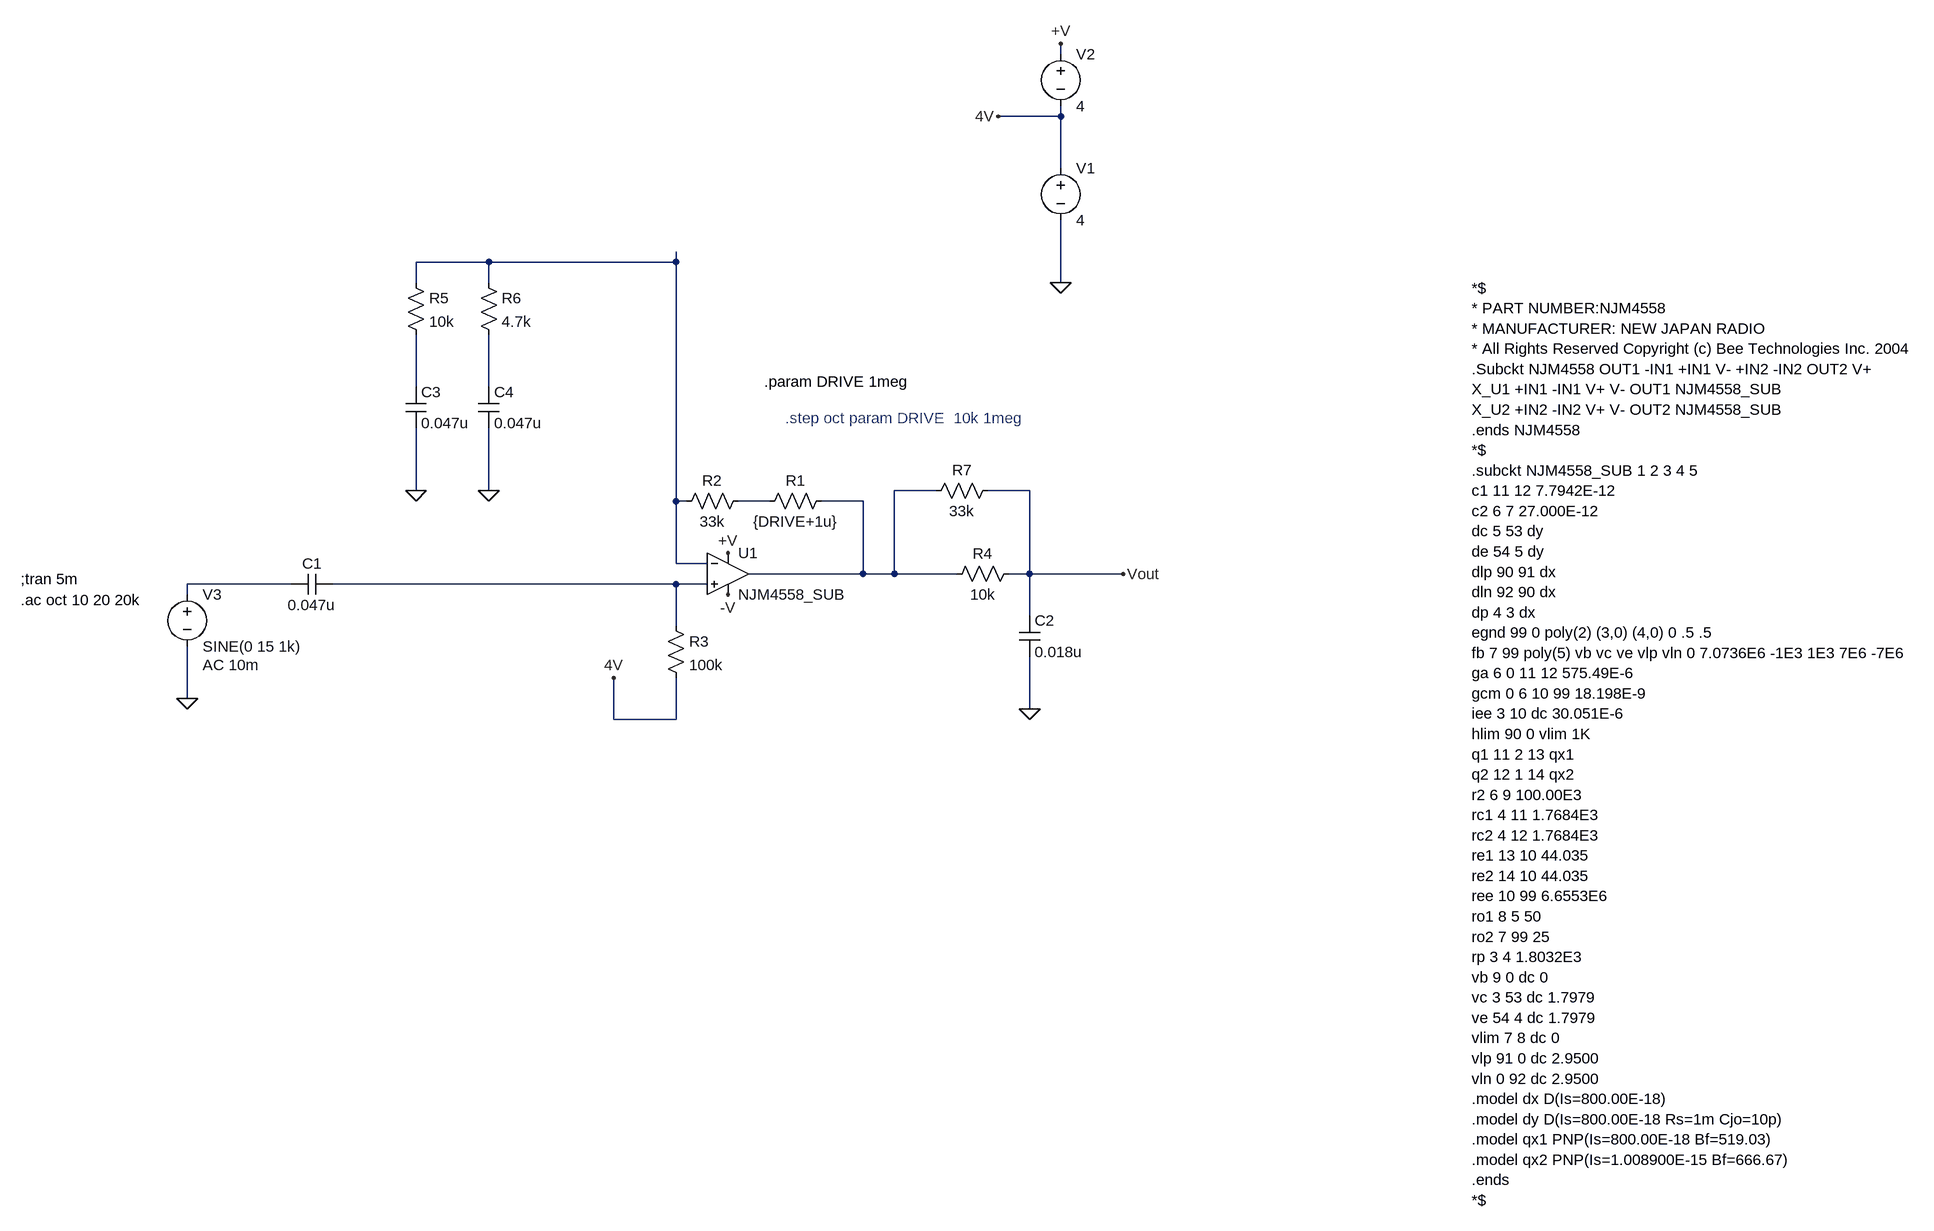
[diagram p0: schematic SD-1filter.asc]
SD-1filter.asc, the LTspice schematic file:
Version 4
SHEET 1 2008 1608
WIRE 560 -160 560 -176
WIRE 560 -64 560 -80
WIRE 560 -64 464 -64
WIRE 560 16 560 -64
WIRE -320 160 -432 160
WIRE -32 160 -32 144
WIRE -32 160 -320 160
WIRE -432 192 -432 160
WIRE -320 192 -320 160
WIRE 560 192 560 96
WIRE -432 352 -432 272
WIRE -320 352 -320 272
WIRE -432 512 -432 416
WIRE -320 512 -320 416
WIRE 368 512 304 512
WIRE 512 512 448 512
WIRE -32 528 -32 160
WIRE -16 528 -32 528
WIRE 112 528 64 528
WIRE 256 528 192 528
WIRE -32 624 -32 528
WIRE 16 624 -32 624
WIRE 256 640 256 528
WIRE 256 640 80 640
WIRE 304 640 304 512
WIRE 304 640 256 640
WIRE 400 640 304 640
WIRE 512 640 512 512
WIRE 512 640 480 640
WIRE 656 640 512 640
WIRE -624 656 -784 656
WIRE -32 656 -560 656
WIRE 16 656 -32 656
WIRE -784 672 -784 656
WIRE 512 704 512 640
WIRE -32 720 -32 656
WIRE -784 832 -784 752
WIRE 512 848 512 768
WIRE -128 864 -128 800
WIRE -32 864 -32 800
WIRE -32 864 -128 864
FLAG -784 832 0
FLAG 560 192 0
FLAG 560 -176 +V
FLAG 48 608 +V
FLAG 48 672 -V
FLAG 464 -64 4V
FLAG -128 800 4V
FLAG 656 640 Vout
FLAG -320 512 0
FLAG -432 512 0
FLAG 512 848 0
SYMBOL Opamps\\opamp2 48 576 R0
SYMATTR InstName U1
SYMATTR Value NJM4558_SUB
SYMBOL voltage 560 0 R0
WINDOW 123 0 0 Left 2
WINDOW 39 0 0 Left 2
SYMATTR InstName V1
SYMATTR Value 4
SYMBOL voltage 560 -176 R0
WINDOW 123 0 0 Left 2
WINDOW 39 0 0 Left 2
SYMATTR InstName V2
SYMATTR Value 4
SYMBOL voltage -784 656 R0
WINDOW 123 24 124 Left 2
WINDOW 39 0 0 Left 2
SYMATTR Value2 AC 10m
SYMATTR InstName V3
SYMATTR Value SINE(0 15 1k)
SYMBOL res 208 512 R90
WINDOW 0 0 56 VBottom 2
WINDOW 3 32 56 VTop 2
SYMATTR InstName R1
SYMATTR Value {DRIVE+1u}
SYMBOL cap -560 640 R90
WINDOW 0 0 32 VBottom 2
WINDOW 3 32 32 VTop 2
SYMATTR InstName C1
SYMATTR Value 0.047u
SYMBOL res -48 704 R0
SYMATTR InstName R3
SYMATTR Value 100k
SYMBOL res 80 512 R90
WINDOW 0 0 56 VBottom 2
WINDOW 3 32 56 VTop 2
SYMATTR InstName R2
SYMATTR Value 33k
SYMBOL res 496 624 R90
WINDOW 0 0 56 VBottom 2
WINDOW 3 32 56 VTop 2
SYMATTR InstName R4
SYMATTR Value 10k
SYMBOL cap 496 704 R0
SYMATTR InstName C2
SYMATTR Value 0.018u
SYMBOL res -448 176 R0
SYMATTR InstName R5
SYMATTR Value 10k
SYMBOL res -336 176 R0
SYMATTR InstName R6
SYMATTR Value 4.7k
SYMBOL cap -448 352 R0
SYMATTR InstName C3
SYMATTR Value 0.047u
SYMBOL cap -336 352 R0
SYMATTR InstName C4
SYMATTR Value 0.047u
SYMBOL res 464 496 R90
WINDOW 0 0 56 VBottom 2
WINDOW 3 32 56 VTop 2
SYMATTR InstName R7
SYMATTR Value 33k
TEXT 1192 200 Left 2 !*$\n* PART NUMBER:NJM4558\n* MANUFACTURER: NEW JAPAN RADIO\n* All Rights Reserved Copyright (c) Bee Technologies Inc. 2004\n.Subckt NJM4558 OUT1 -IN1 +IN1 V- +IN2 -IN2 OUT2 V+\nX_U1 +IN1 -IN1 V+ V- OUT1 NJM4558_SUB\nX_U2 +IN2 -IN2 V+ V- OUT2 NJM4558_SUB\n.ends NJM4558\n*$\n.subckt NJM4558_SUB 1 2 3 4 5\nc1 11 12 7.7942E-12\nc2 6 7 27.000E-12\ndc 5 53 dy\nde 54 5 dy\ndlp 90 91 dx\ndln 92 90 dx\ndp 4 3 dx\negnd 99 0 poly(2) (3,0) (4,0) 0 .5 .5\nfb 7 99 poly(5) vb vc ve vlp vln 0 7.0736E6 -1E3 1E3 7E6 -7E6\nga 6 0 11 12 575.49E-6\ngcm 0 6 10 99 18.198E-9\niee 3 10 dc 30.051E-6\nhlim 90 0 vlim 1K\nq1 11 2 13 qx1\nq2 12 1 14 qx2\nr2 6 9 100.00E3\nrc1 4 11 1.7684E3\nrc2 4 12 1.7684E3\nre1 13 10 44.035\nre2 14 10 44.035\nree 10 99 6.6553E6\nro1 8 5 50\nro2 7 99 25\nrp 3 4 1.8032E3\nvb 9 0 dc 0\nvc 3 53 dc 1.7979\nve 54 4 dc 1.7979\nvlim 7 8 dc 0\nvlp 91 0 dc 2.9500\nvln 0 92 dc 2.9500\n.model dx D(Is=800.00E-18)\n.model dy D(Is=800.00E-18 Rs=1m Cjo=10p)\n.model qx1 PNP(Is=800.00E-18 Bf=519.03)\n.model qx2 PNP(Is=1.008900E-15 Bf=666.67)\n.ends\n*$
TEXT -1040 680 Left 2 !.ac oct 10 20 20k
TEXT -1040 648 Left 2 !;tran 5m
TEXT 104 344 Left 2 !.param DRIVE 1meg
TEXT 136 400 Left 2 ;.step oct param DRIVE  10k 1meg

The netlist it stands for:
* SD-1filter.asc
XU1 N007 N001 +V -V N004 NJM4558_SUB  ; pins In+ In- V+ V- OUT
V1 4V 0 4
V2 +V 4V 4
V3 N006 0 SINE(0 15 1k) AC 10m
R1 N004 N005 {DRIVE+1u}
C1 N007 N006 0.047u
R3 N007 4V 100k
R2 N005 N001 33k
R4 Vout N004 10k
C2 Vout 0 0.018u
R5 N001 N002 10k
R6 N001 N003 4.7k
C3 N002 0 0.047u
C4 N003 0 0.047u
R7 Vout N004 33k
*$
* PART NUMBER:NJM4558
* MANUFACTURER: NEW JAPAN RADIO
* All Rights Reserved Copyright (c) Bee Technologies Inc. 2004
.Subckt NJM4558 OUT1 -IN1 +IN1 V- +IN2 -IN2 OUT2 V+
X_U1 +IN1 -IN1 V+ V- OUT1 NJM4558_SUB
X_U2 +IN2 -IN2 V+ V- OUT2 NJM4558_SUB
.ends NJM4558
*$
.subckt NJM4558_SUB 1 2 3 4 5
c1 11 12 7.7942E-12
c2 6 7 27.000E-12
dc 5 53 dy
de 54 5 dy
dlp 90 91 dx
dln 92 90 dx
dp 4 3 dx
egnd 99 0 poly(2) (3,0) (4,0) 0 .5 .5
fb 7 99 poly(5) vb vc ve vlp vln 0 7.0736E6 -1E3 1E3 7E6 -7E6
ga 6 0 11 12 575.49E-6
gcm 0 6 10 99 18.198E-9
iee 3 10 dc 30.051E-6
hlim 90 0 vlim 1K
q1 11 2 13 qx1
q2 12 1 14 qx2
r2 6 9 100.00E3
rc1 4 11 1.7684E3
rc2 4 12 1.7684E3
re1 13 10 44.035
re2 14 10 44.035
ree 10 99 6.6553E6
ro1 8 5 50
ro2 7 99 25
rp 3 4 1.8032E3
vb 9 0 dc 0
vc 3 53 dc 1.7979
ve 54 4 dc 1.7979
vlim 7 8 dc 0
vlp 91 0 dc 2.9500
vln 0 92 dc 2.9500
.model dx D(Is=800.00E-18)
.model dy D(Is=800.00E-18 Rs=1m Cjo=10p)
.model qx1 PNP(Is=800.00E-18 Bf=519.03)
.model qx2 PNP(Is=1.008900E-15 Bf=666.67)
.ends
*$
.ac oct 10 20 20k
;tran 5m
.param DRIVE 1meg
* .step oct param DRIVE  10k 1meg
.backanno
.end